# Altium schematic sheet 03_GAP9_CHIP_JTAG_XTALs.SchDoc: GAP9Shield
size A3; DrawnBy: Hanna Müller and Victor Kartsch; Organization: Integrated Systems Laboratory; DocumentNumber: 3; Revision: v1.0; SheetNumber: 3; SheetTotal: 9
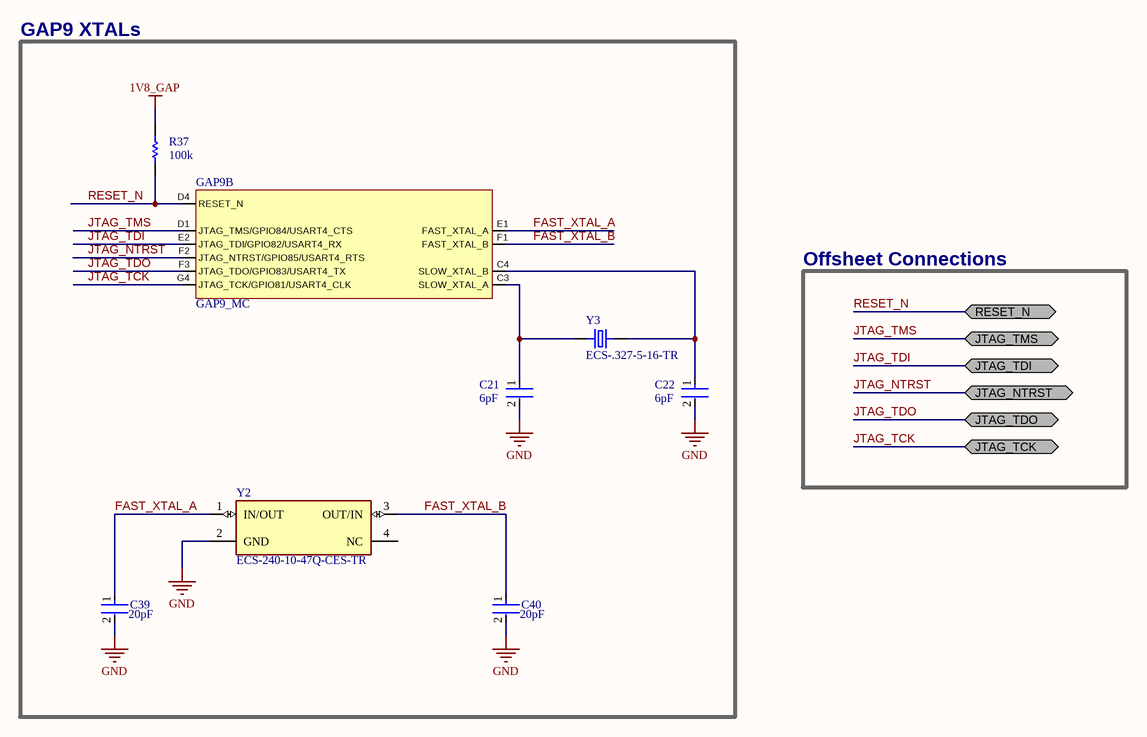
[diagram p0: 03_GAP9_CHIP_JTAG_XTALs.SchDoc]

## Parts
C21  value 6pF  [FP-GJM033-0_03-IPC_A]  (hidden comment: GJM0335G2A6R0WB01D)
C22  value 6pF  [FP-GJM033-0_03-IPC_A]  (hidden comment: GJM0335G2A6R0WB01D)
C39  value 20pF  [CAPC6333_33N_KEM-L]  (hidden comment: CBR02C200F5GAC)
C40  value 20pF  [CAPC6333_33N_KEM-L]  (hidden comment: CBR02C200F5GAC)
GAP9  GAP9_MC  [GAP9]  (part B of 5)
R37  Resistance: 100k  [RESC0201(0603)_N]  (hidden comment: ERJ-1GNF1003C)
Y2  ECS-240-10-47Q-CES-TR  [XTAL_ECS-240-10-47Q-CES-TR]
Y3  ECS-.327-5-16-TR  [XTAL_ECS-.327-5-16-TR]

## Blocks framed on the sheet
GAP9 XTALs: C21 C22 C39 C40 GAP9 R37 Y2 Y3

## Ports
JTAG_NTRST (bidir), JTAG_TCK (bidir), JTAG_TDI (bidir), JTAG_TDO (bidir), JTAG_TMS (bidir), RESET_N (bidir)

## Nets
1V8_GAP: R37.2
GND: C21.2 C22.2 C39.2 C40.2 Y2.2(GND)
FAST_XTAL_A: C39.1 GAP9.E1(FAST_XTAL_A) Y2.1(IN/OUT)
FAST_XTAL_B: C40.1 GAP9.F1(FAST_XTAL_B) Y2.3(OUT/IN)
JTAG_NTRST: GAP9.F2(JTAG_NTRST/GPIO85/USART4_RTS) ; port JTAG_NTRST
JTAG_TCK: GAP9.G4(JTAG_TCK/GPIO81/USART4_CLK) ; port JTAG_TCK
JTAG_TDI: GAP9.E2(JTAG_TDI/GPIO82/USART4_RX) ; port JTAG_TDI
JTAG_TDO: GAP9.F3(JTAG_TDO/GPIO83/USART4_TX) ; port JTAG_TDO
JTAG_TMS: GAP9.D1(JTAG_TMS/GPIO84/USART4_CTS) ; port JTAG_TMS
RESET_N: GAP9.D4(RESET_N) R37.1 ; port RESET_N
NetC21_1: C21.1 GAP9.C3(SLOW_XTAL_A) Y3.1
NetC22_1: C22.1 GAP9.C4(SLOW_XTAL_B) Y3.2

Not connected (* = marked no-connect by the designer): Y2 4(NC)

## Notes on the sheet
- Offsheet Connections
- 1
- 2
- 3
- 4
- 5
- 6
- 7
- 8
- A
- B
- C
- D
- Project:
- Date:
- Drawing number:
- Rev:
- Format:
- A3
- Drawn by:
- Laboratory:
- Page
- Sheet:
- of
- File:

## Library data of the parts
C21 C22 = CMP-06035-009792-1: Ceramic Capacitor 6pF ±0.05pF 100V X8G 0201 (0603 Metric)
C39 C40 = CBR02C200F5GAC: No Description Available; Mfr_Name: Kemet; Type: DEV; Copyright: Copyright (C) 2022 Ultra Librarian. All rights reserved.; Manufacturer_Part_Number: CBR02C200F5GAC; RefDes: RefDes
R37 = CMP-1010-00642-1: 100K 0.05W 1% 0201 (0603 Metric)  SMD; Case-EIA: 0201; Case-Metric: 0603; Technology: SMT; Power: 0.05 W; Tolerance: 1 %; value: 100k
Y2 = ECS-240-10-47Q-CES-TR: 24MHz Â±10ppm Crystal 10pF 150 Ohms 4-SMD, No Lead; MF: ECS Inc.; Value: *; SnapEDA_Link: https://www.snapeda.com/parts/ECS-240-10-47Q-CES-TR/ECS%20Inc./view-part/4221464/?ref=snap; Price: None; Availability: Unavailable; Package: SMD-4 ECS International; MP: ECS-240-10-47Q-CES-TR
Y3 = ECS-.327-5-16-TR: 32.768kHz Â±20ppm Crystal 9pF 90 kOhms 2-SMD, No Lead; MF: ECS Inc.; MP: ECS-.327-9-16-TR; Value: *; SnapEDA_Link: https://www.snapeda.com/parts/ECS-.327-9-16-TR/ECS%20Inc./view-part/620864/?ref=snap; DigiKey-Purchase-URL: https://snapeda.com/shop?store=DigiKey&id=620864; Package: SMD-2 ECS International; Digi-Key_Part_Number: XC2132CT-ND